# Altium project sigma-delta-adc-2.PrjPcb
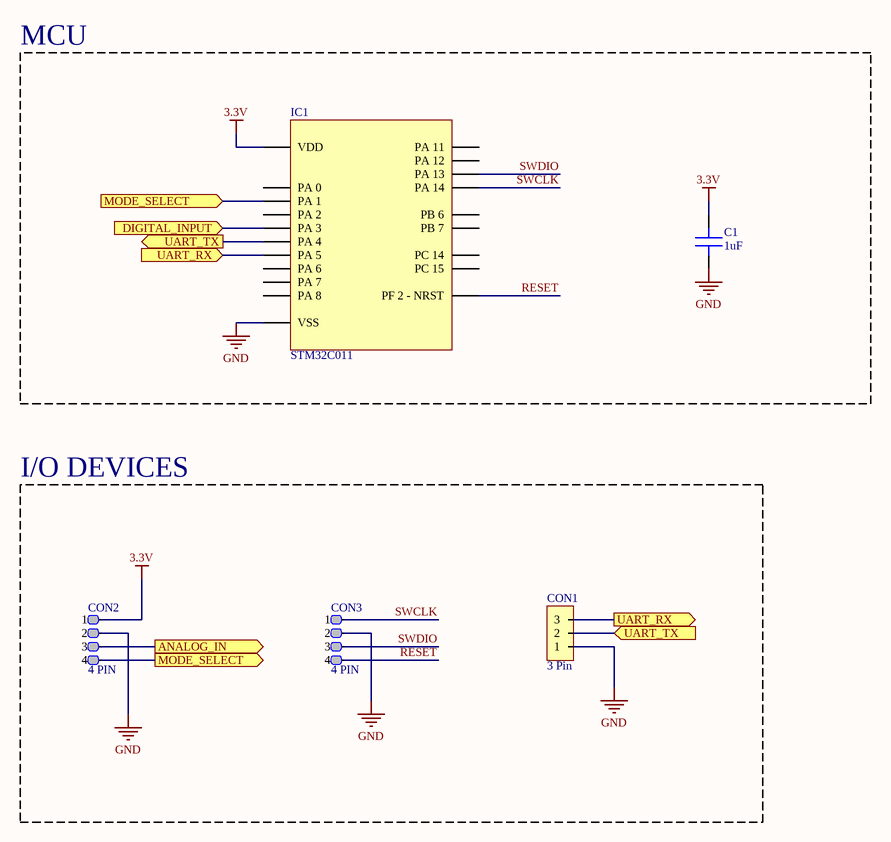
[diagram p0: main.SchDoc]
2 sheets, 12 parts. Net scope: flat (ports and power ports of the same name join across sheets).
Board file: PCB2.PcbDoc
Sheets:
  main.SchDoc
  ADC.SchDoc

## Sheet main.SchDoc
size A4; SheetNumber: 1; SheetTotal: 2

### Parts
C1  1uF  [C 0603]
CON1  3 Pin  [Goldpin 2.54 3P]
CON2  4 PIN  [Goldpin 2.54 4P]
CON3  4 PIN  [BM04B-SRSS-TB]
IC1  STM32C011  [20-UFQFPN]

### Blocks framed on the sheet
MCU: C1 IC1
I/O DEVICES: CON1-CON3

### Ports
ANALOG_IN (out), DIGITAL_INPUT (in), MODE_SELECT (in), MODE_SELECT (out), UART_RX (in), UART_RX (out), UART_TX (in), UART_TX (out)

### Nets
3.3V: C1.1 CON2.1 IC1.2(VDD)
GND: C1.2 CON1.1 CON2.2 CON3.2 IC1.3(VSS)
A_OUT_2: IC1.8(PA_3) ; port DIGITAL_INPUT
A_POS_IN_1: CON2.3 ; port ANALOG_IN
RESET: CON3.4 IC1.4(PF_2_-_NRST)
SWCLK: CON3.1 IC1.17(PA_14)
SWDIO: CON3.3 IC1.16(PA_13)
NetCON1_2: CON1.2 IC1.9(PA_4) ; port UART_TX
NetCON1_3: CON1.3 IC1.10(PA_5) ; port UART_RX
NetCON2_4: CON2.4 IC1.6(PA_1) ; port MODE_SELECT

Not connected (* = marked no-connect by the designer): IC1 1(PC_15) 5(PA_0) 7(PA_2) 11(PA_6) 12(PA_7) 13(PA_8) 14(PA_11) 15(PA_12) 18(PB_6) 19(PB_7) 20(PC_14)

### Library data of the parts
C1 = Capacitor: MLCC Capacitor
IC1 = STM32C011F4U: UFQFPN 20

## Sheet ADC.SchDoc
size A4; SheetNumber: 2; SheetTotal: 2
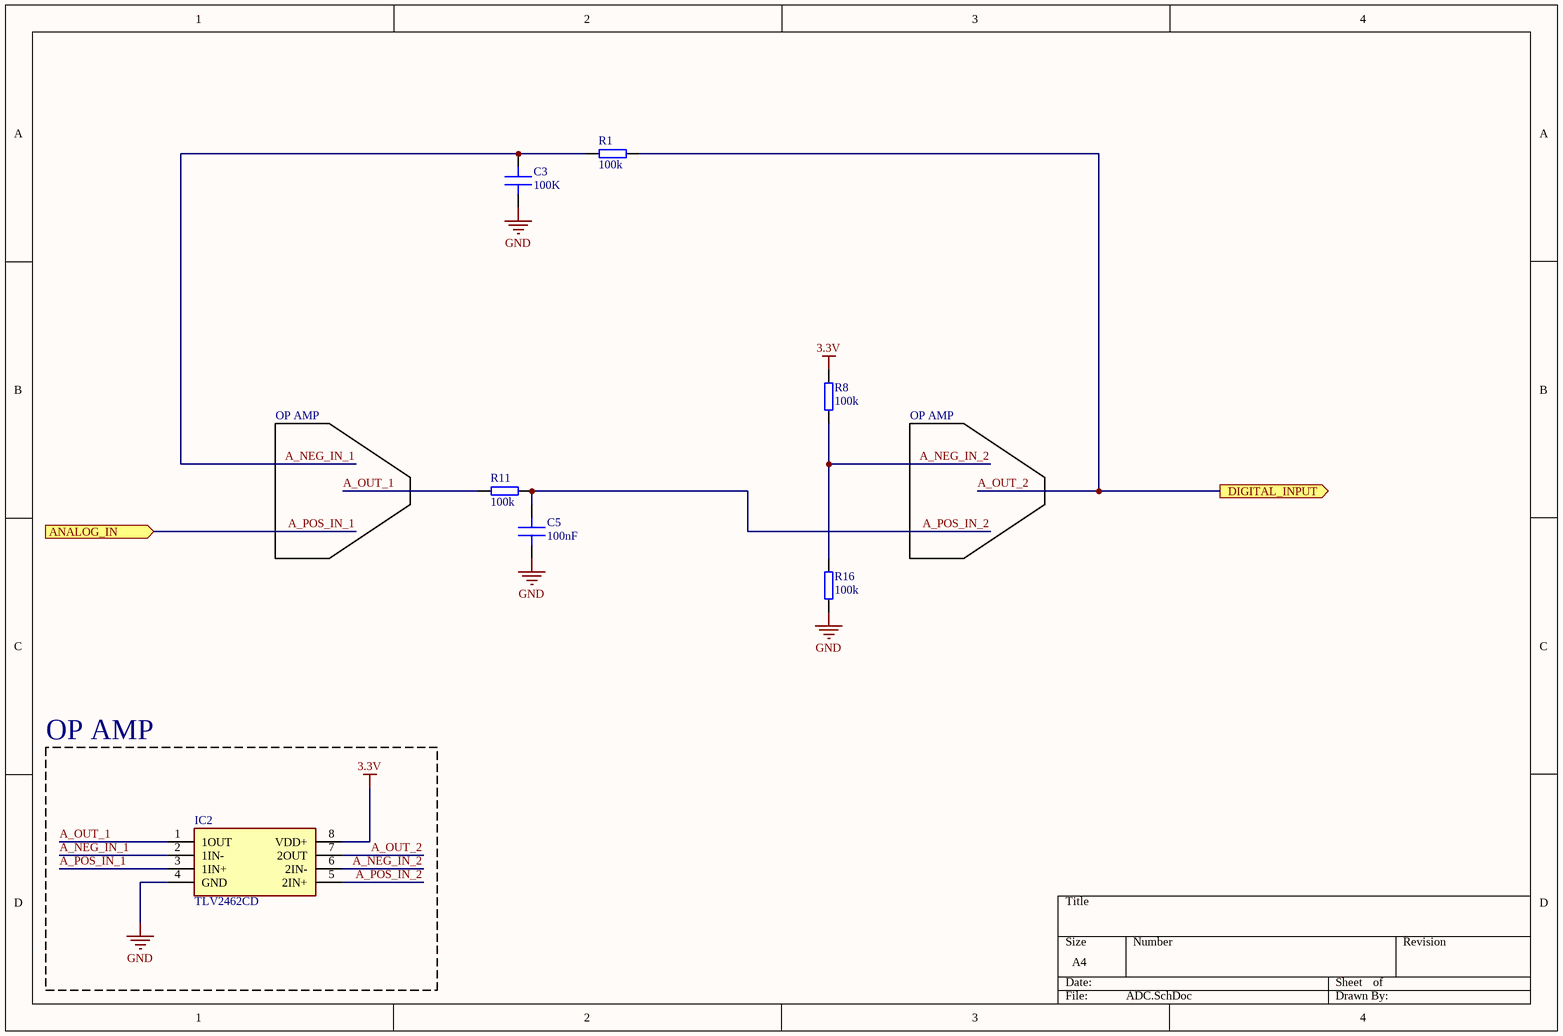
[diagram p1: ADC.SchDoc]

### Parts
C3  100K  [C 0402]
C5  100nF  [C 0402]
IC2  TLV2462CD  [SOIC127P600X175-8N]
R1  100k  [R 0402]
R8  100k  [R 0402]
R11  100k  [R 0402]
R16  100k  [R 0402]

### Blocks framed on the sheet
OP AMP: IC2

### Ports
ANALOG_IN (in), DIGITAL_INPUT (out)

### Nets
3.3V: IC2.8(VDD+) R8.1
GND: C3.2 C5.2 IC2.4(GND) R16.2
A_NEG_IN_1: C3.1 IC2.2(1IN-) R1.2
A_NEG_IN_2: IC2.6(2IN-) R8.2 R16.1
A_OUT_1: IC2.1(1OUT) R11.2
A_OUT_2: IC2.7(2OUT) R1.1 ; port DIGITAL_INPUT
A_POS_IN_1: IC2.3(1IN+) ; port ANALOG_IN
A_POS_IN_2: C5.1 IC2.5(2IN+) R11.1

### Notes on the sheet
- OP AMP

### Library data of the parts
C3 C5 = Capacitor: MLCC Capacitor
IC2 = TLV2462CD: Integrated Circuit; Manufacturer_Name: Texas Instruments; Datasheet Link: http://www.ti.com/lit/ds/symlink/tlv2462.pdf; Height: 1.75mm; Manufacturer_Part_Number: TLV2462CD; Mouser Part Number: 595-TLV2462CD; Mouser Price/Stock: https://www.mouser.co.uk/ProductDetail/Texas-Instruments/TLV2462CD?qs=ZA235jQDfbpG9ihY0Sx8Cg%3D%3D; Arrow Part Number: TLV2462CD; Arrow Price/Stock: https://www.arrow.com/en/products/tlv2462cd/texas-instruments?region=nac
R1 R8 R11 R16 = Resistor: General pourpouse resistor

## Nets that join several sheets
3.3V: main (C1.1 CON2.1 IC1.2), ADC (IC2.8 R8.1)
GND: main (5 pins), ADC (C3.2 C5.2 IC2.4 R16.2)
A_OUT_2: main (IC1.8), ADC (IC2.7 R1.1)
A_POS_IN_1: main (CON2.3), ADC (IC2.3)